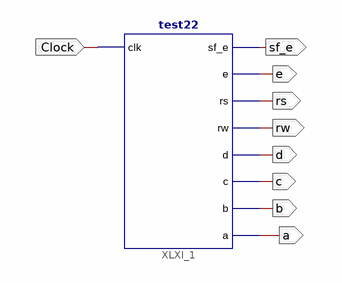
[diagram p0: schematic sheet 1]
// Xilinx ISE schematic testttt.sch (spartan3e) as structural Verilog: 1 symbols, 9 ports
module testttt (
  input  Clock,
  output sf_e,
  output e,
  output rs,
  output rw,
  output d,
  output c,
  output b,
  output a
);

  test22 XLXI_1 (.clk(Clock), .sf_e(sf_e), .e(e), .rs(rs), .rw(rw), .d(d), .c(c), .b(b), .a(a));
endmodule
